# EAGLE design RGB 32x64 Shield for Arduino Mega (EAGLE 9.0.0)
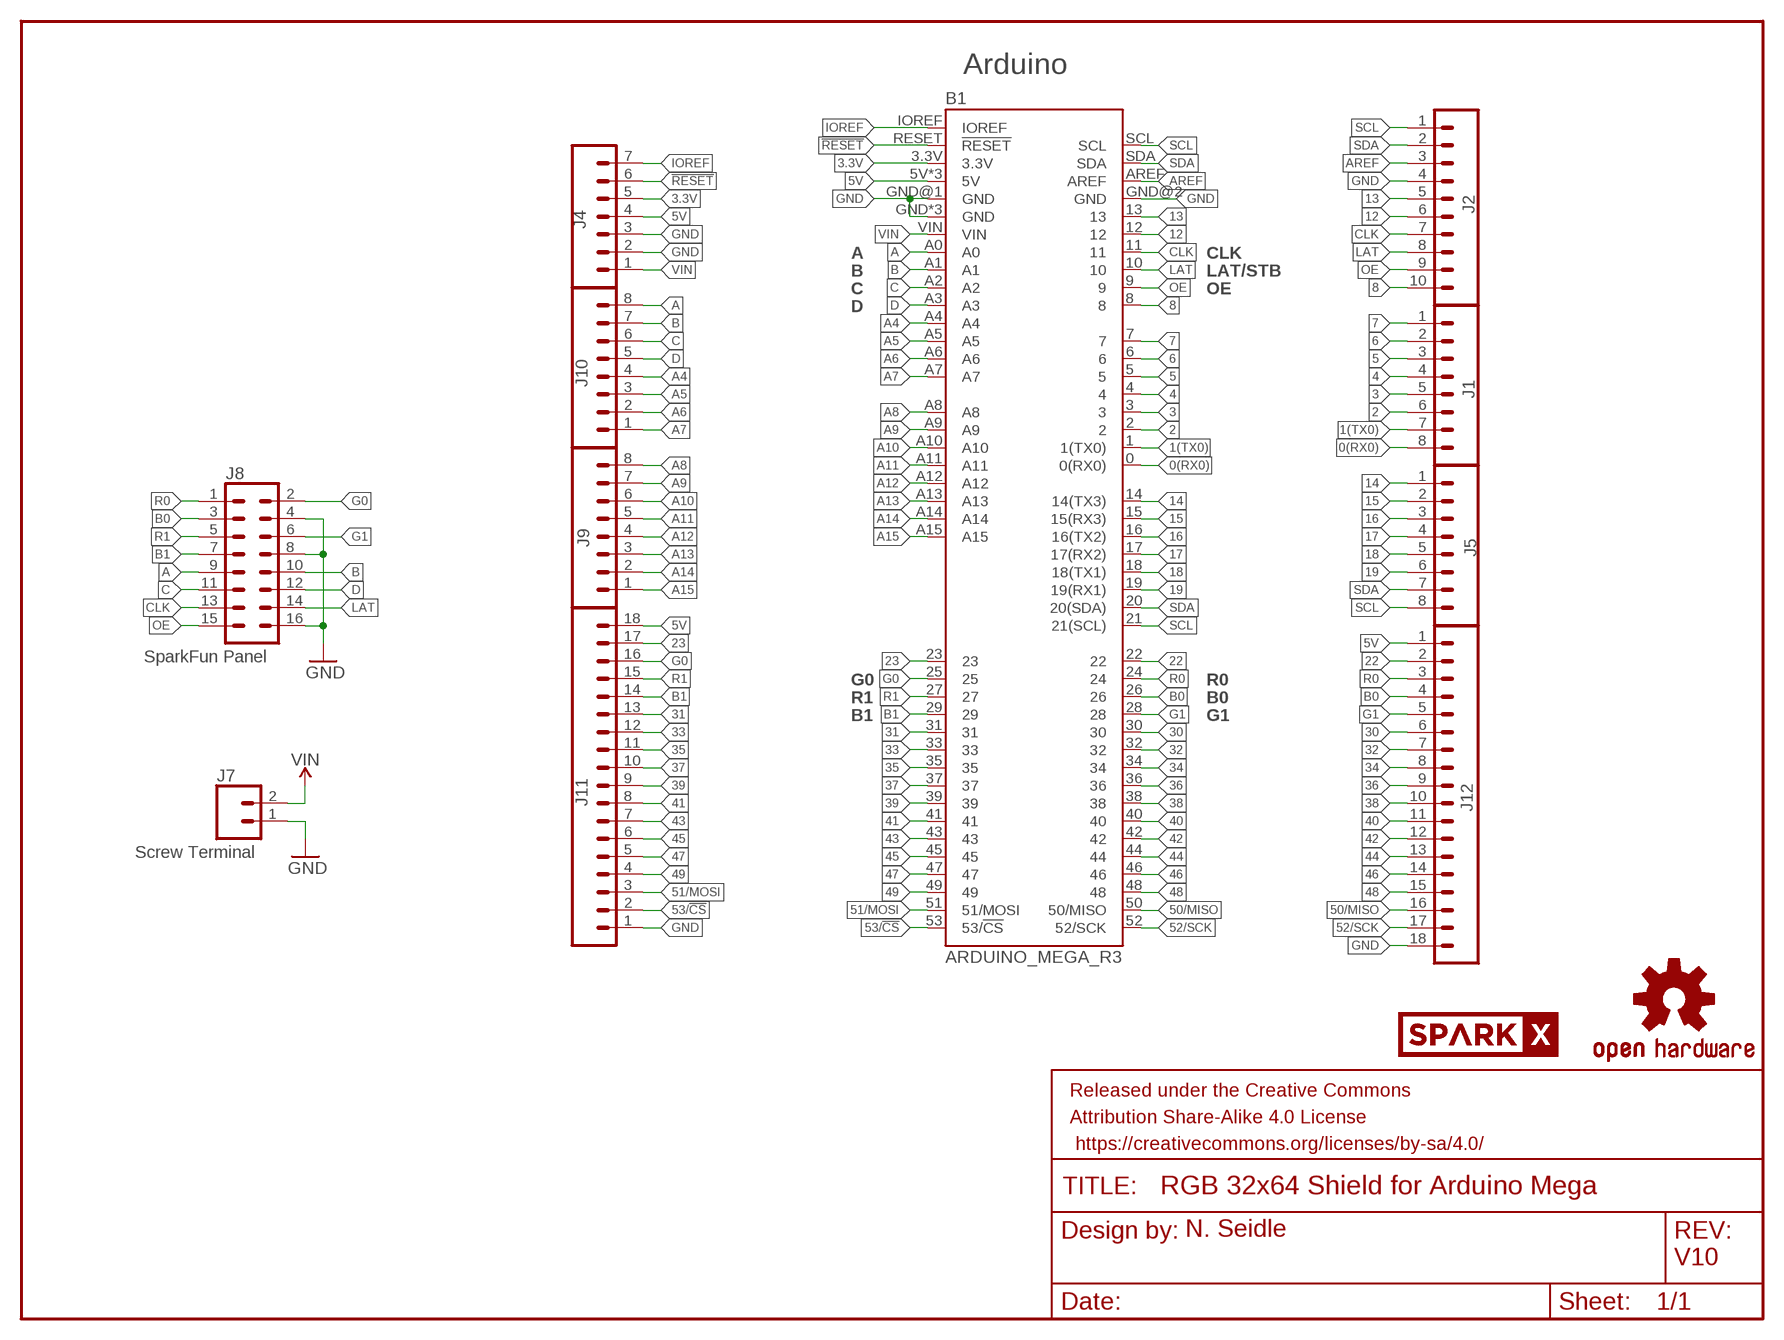
[diagram p0: schematic, sheet 1]

## Parts
B1  ARDUINO_MEGA_R3  ARDUINO_MEGA_R3FULL  [ARDUINO_MEGA_NO_SILK]
FRAME1  FRAME-LETTER  [CREATIVE_COMMONS]
J1  CONN_08NO_SILK_FEMALE_PTH  [1X08_NO_SILK]
J2  CONN_10NO_SILK_PTH_FEMALE  [1X10_NO_SILK]
J4  CONN_07NO_SILK  [1X07_NO_SILK]
J5  CONN_08NO_SILK_FEMALE_PTH  [1X08_NO_SILK]
J7  Screw Terminal  CONN_025MM  [SCREWTERMINAL-5MM-2]
J8  SparkFun Panel  CONN_08X2_SHROUD  [2X8-SHROUDED_LOCK]
J9  CONN_08NO_SILK_FEMALE_PTH  [1X08_NO_SILK]
J10  CONN_08NO_SILK_FEMALE_PTH  [1X08_NO_SILK]
J11  CONN_18  [1X18_NO_SILK]
J12  CONN_18  [1X18_NO_SILK]
LOGO1  OSHW-LOGOMINI  [OSHW-LOGO-MINI]
U$91  SPARKX-LOGO4  [SPARKX-MEDIUM]

## Nets
0(RX0): B1.0(0(RX0)) J1.8
1(TX0): B1.1(1(TX0)) J1.7
2: B1.2 J1.6
3: B1.3 J1.5
3.3V: B1.3.3V J4.5
4: B1.4 J1.4
5: B1.5 J1.3
5V: B1.5V B1.5V@1(5V) B1.5V@2(5V) J4.4 J11.18 J12.1
6: B1.6 J1.2
7: B1.7 J1.1
8: B1.8 J2.10
12: B1.12 J2.6
13: B1.13 J2.5
14: B1.14(14(TX3)) J5.1
15: B1.15(15(RX3)) J5.2
16: B1.16(16(TX2)) J5.3
17: B1.17(17(RX2)) J5.4
18: B1.18(18(TX1)) J5.5
19: B1.19(19(RX1)) J5.6
22: B1.22 J12.2
23: B1.23 J11.17
30: B1.30 J12.6
31: B1.31 J11.13
32: B1.32 J12.7
33: B1.33 J11.12
34: B1.34 J12.8
35: B1.35 J11.11
36: B1.36 J12.9
37: B1.37 J11.10
38: B1.38 J12.10
39: B1.39 J11.9
40: B1.40 J12.11
41: B1.41 J11.8
42: B1.42 J12.12
43: B1.43 J11.7
44: B1.44 J12.13
45: B1.45 J11.6
46: B1.46 J12.14
47: B1.47 J11.5
48: B1.48 J12.15
49: B1.49 J11.4
50/MISO: B1.50(50/MISO) J12.16
51/MOSI: B1.51(51/MOSI) J11.3
52/SCK: B1.52(52/SCK) J12.17
53/!CS: B1.53(53/!CS) J11.2
!RESET: B1.RESET(!RESET) J4.6
A: B1.A0 J8.9 J10.8
A4: B1.A4 J10.4
A5: B1.A5 J10.3
A6: B1.A6 J10.2
A7: B1.A7 J10.1
A8: B1.A8 J9.8
A9: B1.A9 J9.7
A10: B1.A10 J9.6
A11: B1.A11 J9.5
A12: B1.A12 J9.4
A13: B1.A13 J9.3
A14: B1.A14 J9.2
A15: B1.A15 J9.1
AREF: B1.AREF J2.3
B: B1.A1 J8.10 J10.7
B0: B1.26 J8.3 J12.4
B1: B1.29 J8.7 J11.14
C: B1.A2 J8.11 J10.6
CLK: B1.11 J2.7 J8.13
D: B1.A3 J8.12 J10.5
G0: B1.25 J8.2 J11.16
G1: B1.28 J8.6 J12.5
GND [vcc]: B1.GND B1.GND@1(GND) B1.GND@2(GND) B1.GND@3(GND) B1.GND@4(GND) J2.4 J4.2 J4.3 J7.1 J8.4 J8.8 J8.16 J11.1 J12.18
IOREF: B1.IOREF J4.7
LAT: B1.10 J2.8 J8.14
OE: B1.9 J2.9 J8.15
R0: B1.24 J8.1 J12.3
R1: B1.27 J8.5 J11.15
SCL: B1.21(21(SCL)) B1.SCL J2.1 J5.8
SDA: B1.20(20(SDA)) B1.SDA J2.2 J5.7
VIN [vcc]: B1.VIN J4.1 J7.2

## Notes on the sheet
- Arduino
- A | CLK
- B | LAT/STB
- C | OE
- D
- G0 | R0
- R1 | B0
- B1 | G1
- N. Seidle
- V10

## Library data of the parts
B1 = SparkFun-Boards:ARDUINO_MEGA_R3: Arduino Mega R3 ATmega2560 R3 compatible footprint. SparkFun Products: Arduino Mega 2560 R3 <https://www.sparkfun.com/products/11061>
FRAME1 = SparkFun-Aesthetics:FRAME-LETTER: Schematic Frame - Letter Standard 8.5x11 US Letter frame
J1 J5 J9 J10 = SparkFun-Connectors:CONN_08: Multi connection point. Often used as Generic Header-pin footprint for 0.1 inch spaced/style header connections On any of the 0.1 inch spaced packages, you can populate with these: Break Away Headers - Straight <https://www.sparkfun.com/products/116> (PRT-00116) Break Away Male Headers - Right Angle <https://www.sparkfun.com/products/553> (PRT-00553) Female Headers <https://www.sparkfun.com/products/115> (PRT-00115) Break Away Headers - Machine Pin <https://www.sparkfun.com/products/117> (PRT-00117) Break Away Female Headers - Swiss Machine Pin <https://www.sparkfun.com/products/743> (PRT-00743) Arduino Stackable Header - 8 Pin <https://www.sparkfun.com/products/9279> (PRT-09279) For SCREWTERMINALS and SPRING TERMINALS visit here: Screw Terimnals on SparkFun.com <https://www.sparkfun.com/search/results?term=Screw+Terminals> (5mm/3.5mm/2.54mm spacing) This device is also useful as a general connection point to wire up your design to another part of your project. Our various solder wires solder well into these plated through hole pads. Hook-Up Wire - Assortment (Stranded, 22 AWG) <https://www.sparkfun.com/products/11375> (PRT-11375) Hook-Up Wire - Assortment (Solid Core, 22 AWG) <https://www.sparkfun.com/products/11367> (PRT-11367) View the entire wire category on our website here <https://www.sparkfun.com/categories/141> Special notes: Molex polarized connector foot print use with SKU : PRT-08231 with associated crimp pins and housings. 1MM SMD Version SKU: PRT-10208 NOTES ON THE VARIANTS LOCK and LOCK_LONGPADS... This footprint was designed to help hold the alignment of a through-hole component (i.e. 6-pin header) while soldering it into place. You may notice that each hole has been shifted either up or down by 0.005 of an inch from it's more standard position (which is a perfectly straight line). This slight alteration caused the pins (the squares in the middle) to touch the edges of the holes. Because they are alternating, it causes a "brace" to hold the component in place. 0.005 has proven to be the perfect amount of "off-center" position when using our standard breakaway headers. Although looks a little odd when you look at the bare footprint, once you have a header in there, the alteration is very hard to notice. Also,if you push a header all the way into place, it is covered up entirely on the bottom side.; PROD_ID: CONN-08438
J2 = SparkFun-Connectors:CONN_10: Multi connection point. Often used as Generic Header-pin footprint for 0.1 inch spaced/style header connections On any of the 0.1 inch spaced packages, you can populate with these: Break Away Headers - Straight <https://www.sparkfun.com/products/116> (PRT-00116) Break Away Male Headers - Right Angle <https://www.sparkfun.com/products/553> (PRT-00553) Female Headers <https://www.sparkfun.com/products/115> (PRT-00115) Break Away Headers - Machine Pin <https://www.sparkfun.com/products/117> (PRT-00117) Break Away Female Headers - Swiss Machine Pin <https://www.sparkfun.com/products/743> (PRT-00743) Arduino Stackable Header - 10 Pin <https://www.sparkfun.com/products/11376> (PRT-11376) For SCREWTERMINALS and SPRING TERMINALS visit here: Screw Terimnals on SparkFun.com <https://www.sparkfun.com/search/results?term=Screw+Terminals> (5mm/3.5mm/2.54mm spacing) This device is also useful as a general connection point to wire up your design to another part of your project. Our various solder wires solder well into these plated through hole pads. Hook-Up Wire - Assortment (Stranded, 22 AWG) <https://www.sparkfun.com/products/11375> (PRT-11375) Hook-Up Wire - Assortment (Solid Core, 22 AWG) <https://www.sparkfun.com/products/11367> (PRT-11367) View the entire wire category on our website here <https://www.sparkfun.com/categories/141> Special notes: Molex polarized connector foot print use with SKU : PRT-08231 with associated crimp pins and housings. 1MM SMD Version SKU: PRT-10208 NOTES ON THE VARIANTS LOCK and LOCK_LONGPADS... This footprint was designed to help hold the alignment of a through-hole component (i.e. 6-pin header) while soldering it into place. You may notice that each hole has been shifted either up or down by 0.005 of an inch from it's more standard position (which is a perfectly straight line). This slight alteration caused the pins (the squares in the middle) to touch the edges of the holes. Because they are alternating, it causes a "brace" to hold the component in place. 0.005 has proven to be the perfect amount of "off-center" position when using our standard breakaway headers. Although looks a little odd when you look at the bare footprint, once you have a header in there, the alteration is very hard to notice. Also,if you push a header all the way into place, it is covered up entirely on the bottom side.; PROD_ID: CONN-11563
J4 = SparkFun-Connectors:CONN_07: Multi connection point. Often used as Generic Header-pin footprint for 0.1 inch spaced/style header connections On any of the 0.1 inch spaced packages, you can populate with these: Break Away Headers - Straight <https://www.sparkfun.com/products/116> (PRT-00116) Break Away Male Headers - Right Angle <https://www.sparkfun.com/products/553> (PRT-00553) Female Headers <https://www.sparkfun.com/products/115> (PRT-00115) Break Away Headers - Machine Pin <https://www.sparkfun.com/products/117> (PRT-00117) Break Away Female Headers - Swiss Machine Pin <https://www.sparkfun.com/products/743> (PRT-00743) For SCREWTERMINALS and SPRING TERMINALS visit here: Screw Terimnals on SparkFun.com <https://www.sparkfun.com/search/results?term=Screw+Terminals> (5mm/3.5mm/2.54mm spacing) This device is also useful as a general connection point to wire up your design to another part of your project. Our various solder wires solder well into these plated through hole pads. Hook-Up Wire - Assortment (Stranded, 22 AWG) <https://www.sparkfun.com/products/11375> (PRT-11375) Hook-Up Wire - Assortment (Solid Core, 22 AWG) <https://www.sparkfun.com/products/11367> (PRT-11367) View the entire wire category on our website here <https://www.sparkfun.com/categories/141> Special notes: Molex polarized connector foot print use with SKU : PRT-08231 with associated crimp pins and housings. 1MM SMD Version SKU: PRT-10208 NOTES ON THE VARIANTS LOCK and LOCK_LONGPADS... This footprint was designed to help hold the alignment of a through-hole component (i.e. 6-pin header) while soldering it into place. You may notice that each hole has been shifted either up or down by 0.005 of an inch from it's more standard position (which is a perfectly straight line). This slight alteration caused the pins (the squares in the middle) to touch the edges of the holes. Because they are alternating, it causes a "brace" to hold the component in place. 0.005 has proven to be the perfect amount of "off-center" position when using our standard breakaway headers. Although looks a little odd when you look at the bare footprint, once you have a header in there, the alteration is very hard to notice. Also,if you push a header all the way into place, it is covered up entirely on the bottom side.
J7 = SparkFun-Connectors:CONN_02: Multi connection point. Often used as Generic Header-pin footprint for 0.1 inch spaced/style header connections On any of the 0.1 inch spaced packages, you can populate with these: Break Away Headers - Straight <https://www.sparkfun.com/products/116> (PRT-00116) Break Away Male Headers - Right Angle <https://www.sparkfun.com/products/553> (PRT-00553) Female Headers <https://www.sparkfun.com/products/115> (PRT-00115) Break Away Headers - Machine Pin <https://www.sparkfun.com/products/117> (PRT-00117) Break Away Female Headers - Swiss Machine Pin <https://www.sparkfun.com/products/743> (PRT-00743) For SCREWTERMINALS and SPRING TERMINALS visit here: Screw Terimnals on SparkFun.com <https://www.sparkfun.com/search/results?term=Screw+Terminals> (5mm/3.5mm/2.54mm spacing) This device is also useful as a general connection point to wire up your design to another part of your project. Our various solder wires solder well into these plated through hole pads. Hook-Up Wire - Assortment (Stranded, 22 AWG) <https://www.sparkfun.com/products/11375> (PRT-11375) Hook-Up Wire - Assortment (Solid Core, 22 AWG) <https://www.sparkfun.com/products/11367> (PRT-11367) View the entire wire category on our website here <https://www.sparkfun.com/categories/141> Special notes: Molex polarized connector foot print use with: PRT-08233 with associated crimp pins and housings. 2.54_SCREWTERM for use with PRT-10571. 3.5mm Screw Terminal footprints for PRT-08084 5mm Screw Terminal footprints for use with PRT-08432; SF_SKU: PRT-08432
J8 = SparkFun-Connectors:CONN_08X2: Multi connection point. Often used as Generic Header-pin footprint for 0.1 inch spaced/style header connections You can populate with any combo of single row headers, but if you'd like an exact match, check this: Header - 2x8 (Male, 0.1") <https://www.sparkfun.com/products/13156> (PRT-13156) On any of the 0.1 inch spaced packages, you can populate with these: Break Away Headers - Straight <https://www.sparkfun.com/products/116> (PRT-00116) Break Away Male Headers - Right Angle <https://www.sparkfun.com/products/553> (PRT-00553) Female Headers <https://www.sparkfun.com/products/115> (PRT-00115) Break Away Headers - Machine Pin <https://www.sparkfun.com/products/117> (PRT-00117) Break Away Female Headers - Swiss Machine Pin <https://www.sparkfun.com/products/743> (PRT-00743)
J11 J12 = SparkFun-Connectors:CONN_18: Multi connection point. Often used as Generic Header-pin footprint for 0.1 inch spaced/style header connections On any of the 0.1 inch spaced packages, you can populate with these: Break Away Headers - Straight <https://www.sparkfun.com/products/116> (PRT-00116) Break Away Male Headers - Right Angle <https://www.sparkfun.com/products/553> (PRT-00553) Female Headers <https://www.sparkfun.com/products/115> (PRT-00115) Break Away Headers - Machine Pin <https://www.sparkfun.com/products/117> (PRT-00117) Break Away Female Headers - Swiss Machine Pin <https://www.sparkfun.com/products/743> (PRT-00743) For SCREWTERMINALS and SPRING TERMINALS visit here: Screw Terimnals on SparkFun.com <https://www.sparkfun.com/search/results?term=Screw+Terminals> (5mm/3.5mm/2.54mm spacing) This device is also useful as a general connection point to wire up your design to another part of your project. Our various solder wires solder well into these plated through hole pads. Hook-Up Wire - Assortment (Stranded, 22 AWG) <https://www.sparkfun.com/products/11375> (PRT-11375) Hook-Up Wire - Assortment (Solid Core, 22 AWG) <https://www.sparkfun.com/products/11367> (PRT-11367) View the entire wire category on our website here <https://www.sparkfun.com/categories/141> Special notes: Molex polarized connector foot print use with SKU : PRT-08231 with associated crimp pins and housings. 1MM SMD Version SKU: PRT-10208 NOTES ON THE VARIANTS LOCK and LOCK_LONGPADS... This footprint was designed to help hold the alignment of a through-hole component (i.e. 6-pin header) while soldering it into place. You may notice that each hole has been shifted either up or down by 0.005 of an inch from it's more standard position (which is a perfectly straight line). This slight alteration caused the pins (the squares in the middle) to touch the edges of the holes. Because they are alternating, it causes a "brace" to hold the component in place. 0.005 has proven to be the perfect amount of "off-center" position when using our standard breakaway headers. Although looks a little odd when you look at the bare footprint, once you have a header in there, the alteration is very hard to notice. Also,if you push a header all the way into place, it is covered up entirely on the bottom side.
LOGO1 = SparkFun-Aesthetics:OSHW-LOGO: Open-Source Hardware (OSHW) Logo This logo indicates the piece of hardware it is found on incorporates a OSHW license and/or adheres to the definition of open source hardware found here: http://freedomdefined.org/OSHW
U$91 = SparkX:SPARKX-LOGO

## Net classes
0 Default: width 0.152 mm
1 vcc: width 0.152 mm

## Board
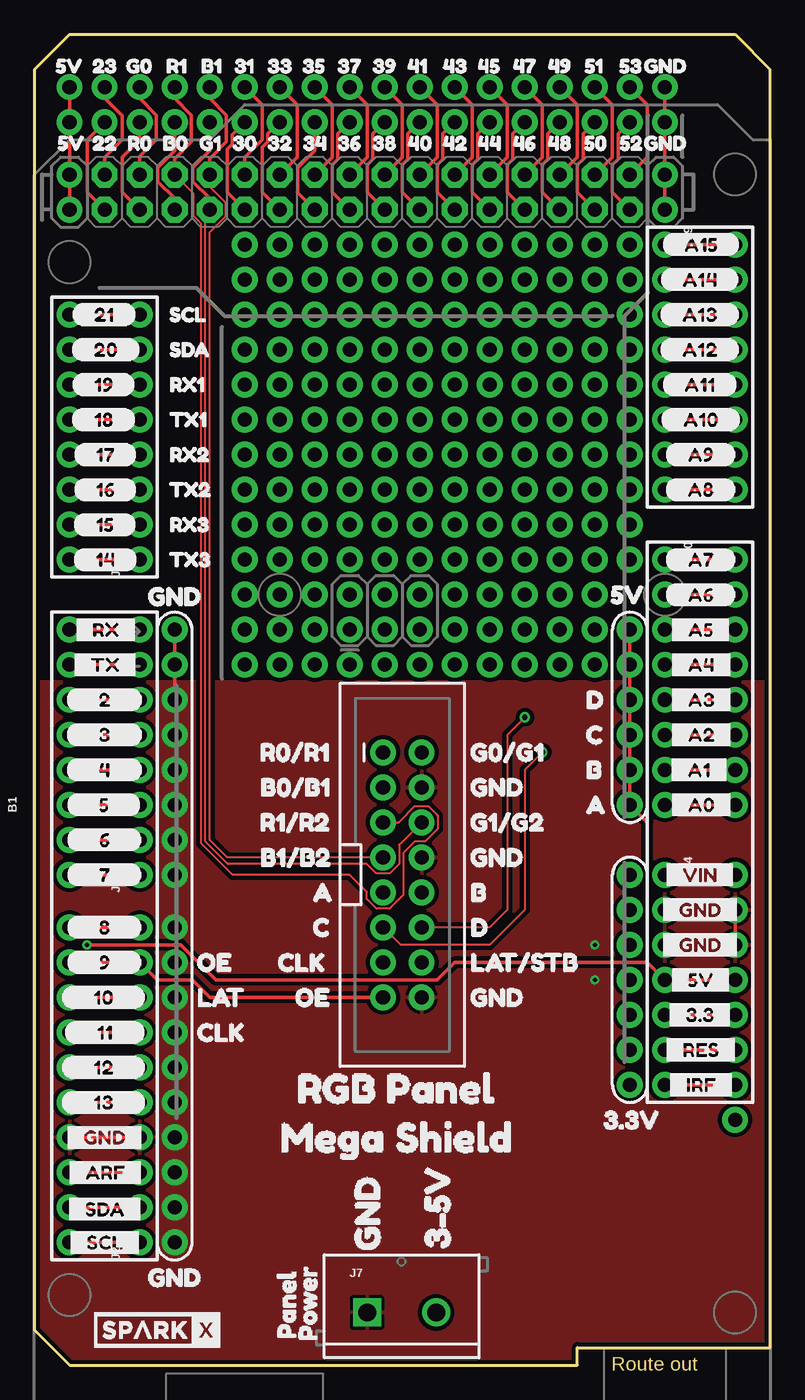
[diagram p1: board, top side]
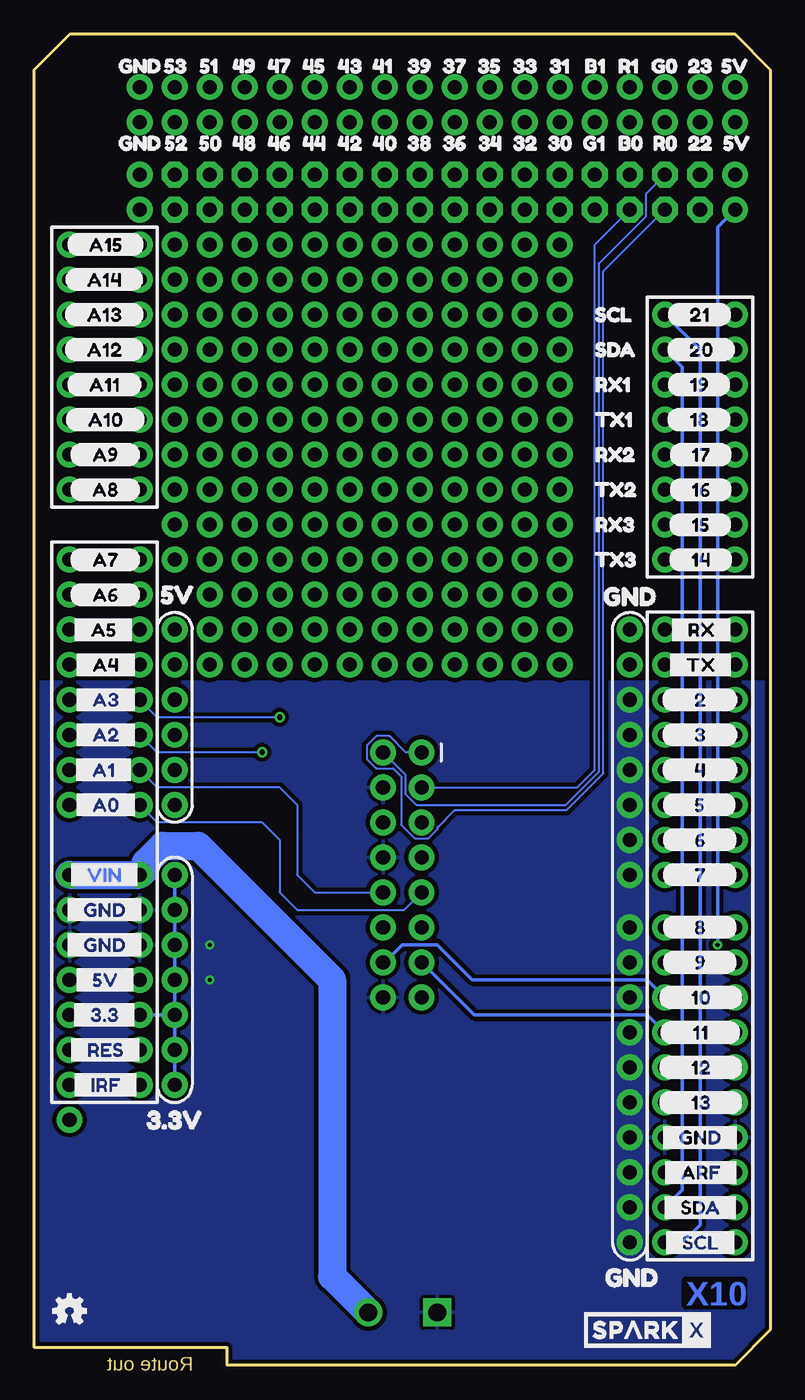
[diagram p2: board, bottom side, seen from below]

Size 53.34 x 96.52 mm. Coordinates in mm from the lower left corner, seen from the top.
Outline: 53.34,1.27 53.34,93.98 50.8,96.52 2.54,96.52 0,93.98 0,2.54 2.54,0 39.37,0 39.37,1.27 53.34,1.27
Copper layers (1*16): Top 0.035mm / dielectric 1.5mm / Bottom 0.035mm
Design rules "SparkFun-2-layer-PCBWay-LIMIT": minimum track width 6mil, minimum drill 0.3mm, track to track 6mil, track to pad 6mil, pad to pad 6mil, via to via 6mil, smd to smd 6mil, copper to edge 6mil, drill to drill 6mil, minimum pad ring 7mil, minimum via ring 7mil, stop-mask expansion 4mil, vias tented up to drill 25mil, thermal gap 10mil

### Footprints (pad centres in the part's own frame; a part is rotated, then mirrored left to right if it is on the bottom)
ARDUINO_MEGA_NO_SILK = drill 1.016 pad 1.88: 0 13.97,24.13; 1 11.43,24.13; 2 8.89,24.13; 3 6.35,24.13; 3.3V -13.97,-24.13; 4 3.81,24.13; 5 1.27,24.13; 5V -11.43,-24.13; 5V@1 44.45,24.13; 5V@2 46.99,24.13; 6 -1.27,24.13; 7 -3.81,24.13; 8 -7.62,24.13; 9 -10.16,24.13; 10 -12.7,24.13; 11 -15.24,24.13; 12 -17.78,24.13; 13 -20.32,24.13; 14 19.05,24.13; 15 21.59,24.13; 16 24.13,24.13; 17 26.67,24.13; 18 29.21,24.13; 19 31.75,24.13; 20 34.29,24.13; 21 36.83,24.13; A0 1.27,-24.13; A1 3.81,-24.13; A2 6.35,-24.13; A3 8.89,-24.13; A4 11.43,-24.13; A5 13.97,-24.13; A6 16.51,-24.13; A7 19.05,-24.13; A8 24.13,-24.13; A9 26.67,-24.13; A10 29.21,-24.13; A11 31.75,-24.13; A12 34.29,-24.13; A13 36.83,-24.13; A14 39.37,-24.13; A15 41.91,-24.13; AREF -25.4,24.13; GND -8.89,-24.13; GND@1 -6.35,-24.13; GND@2 44.45,-19.05; GND@3 46.99,-19.05; GND@4 -22.86,24.13; IOREF -19.05,-24.13; NC -21.59,-24.13; RESET -16.51,-24.13; SCL -30.48,24.13; SDA -27.94,24.13; VIN -3.81,-24.13 | drill 1.016 pad 1.88 octagon: 22 44.45,21.59; 23 46.99,21.59; 24 44.45,19.05; 25 46.99,19.05; 26 44.45,16.51; 27 46.99,16.51; 28 44.45,13.97; 29 46.99,13.97; 30 44.45,11.43; 31 46.99,11.43; 32 44.45,8.89; 33 46.99,8.89; 34 44.45,6.35; 35 46.99,6.35; 36 44.45,3.81; 37 46.99,3.81; 38 44.45,1.27; 39 46.99,1.27; 40 44.45,-1.27; 41 46.99,-1.27; 42 44.45,-3.81; 43 46.99,-3.81; 44 44.45,-6.35; 45 46.99,-6.35; 46 44.45,-8.89; 47 46.99,-8.89; 48 44.45,-11.43; 49 46.99,-11.43; 50 44.45,-13.97; 51 46.99,-13.97; 52 44.45,-16.51; 53 46.99,-16.51
1X08_NO_SILK = drill 1.016 pad 1.88: 1 0,0; 2 2.54,0; 3 5.08,0; 4 7.62,0; 5 10.16,0; 6 12.7,0; 7 15.24,0; 8 17.78,0
1X10_NO_SILK = drill 1.016 pad 1.88: 1 0,0; 2 2.54,0; 3 5.08,0; 4 7.62,0; 5 10.16,0; 6 12.7,0; 7 15.24,0; 8 17.78,0; 9 20.32,0; 10 22.86,0
1X07_NO_SILK = drill 1.016 pad 1.88: 1 0,0; 2 2.54,0; 3 5.08,0; 4 7.62,0; 5 10.16,0; 6 12.7,0; 7 15.24,0
SCREWTERMINAL-5MM-2 = drill 1.3 pad 2.032 square: 1 0,0 | drill 1.3 pad 2.032: 2 5,0
2X8-SHROUDED_LOCK = drill 1.016 pad 1.88: 1 -1.397,8.89; 2 1.397,8.89; 3 -1.397,6.35; 4 1.397,6.35; 5 -1.397,3.81; 6 1.397,3.81; 7 -1.397,1.27; 8 1.397,1.27; 9 -1.397,-1.27; 10 1.397,-1.27; 11 -1.397,-3.81; 12 1.397,-3.81; 13 -1.397,-6.35; 14 1.397,-6.35; 15 -1.397,-8.89; 16 1.397,-8.89
1X18_NO_SILK = drill 1.016 pad 1.88: 1 0,0; 2 2.54,0; 3 5.08,0; 4 7.62,0; 5 10.16,0; 6 12.7,0; 7 15.24,0; 8 17.78,0; 9 20.32,0; 10 22.86,0; 11 25.4,0; 12 27.94,0; 13 30.48,0; 14 33.02,0; 15 35.56,0; 16 38.1,0; 17 40.64,0; 18 43.18,0

### Placement (x,y rotation side)
B1  26.67,39.37 90 top
FRAME1  -8.89,-29.21 0 top  (outside the outline)
J1  7.62,35.56 90 top
J2  7.62,8.89 90 top
J4  45.72,35.56 270 top
J5  7.62,58.42 90 top
J7  24.13,3.81 0 top
J8  26.67,35.56 0 top
J9  45.72,81.28 270 top
J10  45.72,58.42 270 top
J11  45.72,92.71 180 top
J12  2.54,90.17 0 top
LOGO1  50.8,3.94 0 bottom
U$1  [D42]  38.86,48.26 0 top
U$2  [__A6__0]  45.72,55.88 0 top
U$3  [C37]  19.05,31.75 0 top
U$4  [GND48]  30.48,41.91 0 top
U$5  [3#5V3]  29.21,6.86 90 top
U$6  [____2____1]  2.29,48.26 0 top
U$7  [____3____3]  2.29,45.72 0 top
U$8  [____4____4]  2.29,43.18 0 top
U$9  [____5____5]  2.29,40.64 0 top
U$10  [____6____6]  2.29,38.1 0 top
U$11  [GND2]  24.13,6.73 90 top
U$12  [____7____7]  2.29,35.56 0 top
U$13  [____8____8]  2.29,31.75 0 top
U$14  [____9____9]  2.29,29.21 0 top
U$15  [____10____10]  1.91,26.67 0 top
U$16  [PANEL0]  18.29,0.76 90 top
U$17  [____11____11]  2.16,24.13 0 top
U$18  [____12____12]  1.91,21.59 0 top
U$19  [POWER1]  19.81,0.64 90 top
U$20  [____13____13]  1.91,19.05 0 top
U$21  [GND40]  7.11,6.35 0 top
U$22  [GND40]  7.11,55.75 0 top
U$23  [RGB_PANEL2]  17.27,20.07 0 top
U$24  [__RX__0]  2.54,53.34 0 top
U$25  [3#3V46]  40.13,17.78 0 top
U$26  [5V47]  40.64,55.88 0 top
U$27  [__3#3__27]  50.93,25.4 0 bottom
U$28  [A36]  19.05,34.29 0 top
U$29  [B0#B132]  15.24,41.91 0 top
U$30  [B1#B235]  15.24,36.83 0 top
U$31  [B43]  30.48,34.29 0 top
U$32  [C37]  19.05,31.75 0 top
U$33  [CLK38]  16.51,29.21 0 top
U$34  [D42]  30.48,31.75 0 top
U$35  [G0#G145]  30.48,44.45 0 top
U$36  [G1#G244]  30.48,39.37 0 top
U$37  [GND40]  30.48,26.67 0 top
U$38  [GND48]  30.48,36.83 0 top
U$39  [LAT#STB41]  30.48,29.21 0 top
U$40  [OE39]  17.78,26.67 0 top
U$41  [R0#R131]  15.24,44.45 0 top
U$42  [R1#R234]  15.24,39.37 0 top
U$43  [__5V__26]  50.8,27.94 0 bottom
U$44  [__A0__23]  45.72,40.64 0 top
U$45  [__3#3__27]  45.59,25.4 0 top
U$46  [__A1__22]  45.72,43.18 0 top
U$47  [__A2__21]  45.72,45.72 0 top
U$48  [__5V__26]  45.72,27.94 0 top
U$49  [__A3__20]  45.72,48.26 0 top
U$50  [__A4__19]  45.72,50.8 0 top
U$51  [__A5__18]  45.72,53.34 0 top
U$52  [__ARF__15]  2.03,13.97 0 top
U$53  [__GND__14]  1.91,16.51 0 top
U$54  [__GND__25]  45.09,30.48 0 top
U$55  [__GND__25]  45.09,33.02 0 top
U$56  [__IRF__29]  45.59,20.32 0 top
U$57  [__RES__28]  45.34,22.86 0 top
U$58  [__SCL__17]  2.16,8.89 0 top
U$59  [__SDA__16]  2.03,11.3 0 top
U$60  [__TX__0]  2.41,50.8 0 top
U$61  [__VIN__24]  45.34,35.56 0 top
U$62  [__A0__23]  50.8,40.64 0 bottom
U$63  [__A1__22]  50.8,43.18 0 bottom
U$64  [__A2__21]  50.8,45.72 0 bottom
U$65  [__A3__20]  50.8,48.26 0 bottom
U$66  [__A4__19]  50.8,50.8 0 bottom
U$67  [__GND__25]  51.44,30.48 0 bottom
U$68  [__GND__25]  51.44,33.02 0 bottom
U$69  [__RES__28]  51.18,22.86 0 bottom
U$70  [__VIN__24]  51.18,35.56 0 bottom
U$71  [__IRF__29]  50.93,20.32 0 bottom
U$72  [__A5__18]  50.93,53.34 0 bottom
U$73  [__RX__0]  7.62,53.34 0 bottom
U$74  [__ARF__15]  8.13,13.97 0 bottom
U$75  [__GND__14]  8.26,16.51 0 bottom
U$76  [__SCL__17]  8,8.89 0 bottom
U$77  [__SDA__16]  8.13,11.43 0 bottom
U$78  [__TX__0]  7.75,50.8 0 bottom
U$79  [____2____1]  7.87,48.26 0 bottom
U$80  [____3____3]  7.87,45.72 0 bottom
U$81  [____4____4]  7.87,43.18 0 bottom
U$82  [____5____5]  7.87,40.64 0 bottom
U$83  [____6____6]  7.87,38.1 0 bottom
U$84  [____7____7]  7.87,35.56 0 bottom
U$85  [____8____8]  7.87,31.75 0 bottom
U$86  [____9____9]  7.87,29.21 0 bottom
U$87  [____10____10]  8.13,26.67 0 bottom
U$88  [____11____11]  8,24.13 0 bottom
U$89  [____12____12]  8.13,21.59 0 bottom
U$90  [____13____13]  8.13,19.05 0 bottom
U$91  8.89,2.54 0 top
U$92  [__A7__0]  45.72,58.42 0 top
U$93  [__A8__1]  45.72,63.5 0 top
U$94  [__A9__2]  45.72,66.04 0 top
U$95  [__A10__3]  45.21,68.58 0 top
U$96  [__A11__4]  45.47,71.12 0 top
U$97  [__A12__5]  45.34,73.66 0 top
U$98  [__A13__6]  45.34,76.2 0 top
U$99  [__A14__7]  45.34,78.74 0 top
U$100  [__A15__8]  45.47,81.28 0 top
U$101  [__14__0]  2.79,58.42 0 top
U$102  [__15__1]  2.79,60.96 0 top
U$103  [__16__2]  2.79,63.5 0 top
U$104  [__17__3]  2.79,66.04 0 top
U$105  [__18__4]  2.67,68.58 0 top
U$106  [__19__5]  2.67,71.12 0 top
U$107  [5V47]  45.34,55.88 0 bottom
U$108  [GND40]  13.21,55.75 0 bottom
U$109  [GND40]  13.08,6.35 0 bottom
U$110  [3#3V46]  46.35,17.78 0 bottom
U$111  [__20__6]  2.67,73.66 0 top
U$112  [__14__0]  7.37,58.42 0 bottom
U$113  [C37]  38.86,45.72 0 top
U$114  [B43]  38.86,43.18 0 top
U$115  [A36]  38.86,40.64 0 top
U$116  [__15__1]  7.37,60.96 0 bottom
U$117  [__16__2]  7.37,63.5 0 bottom
U$118  [__17__3]  7.37,66.04 0 bottom
U$119  [__18__4]  7.49,68.58 0 bottom
U$120  [__19__5]  7.49,71.12 0 bottom
U$121  [CLK38]  10.67,24.13 0 top
U$122  [OE39]  10.67,29.21 0 top
U$123  [LAT0]  10.67,26.67 0 top
U$124  [SHIELD0]  24.38,16.51 0 top
U$125  [__21__7]  2.67,76.2 0 top
U$126  [TX30]  8.89,58.42 0 top
U$127  [SDA2]  8.89,73.66 0 top
U$128  [SPARKX-MEDIUM]  8.89,2.54 0 bottom
U$129  [SCL3]  8.89,76.2 0 top
U$130  [RX31]  8.89,60.96 0 top
U$131  [MEGA4]  16,16.51 0 top
U$132  [__20__6]  7.49,73.66 0 bottom
U$133  [2232]  3.3,88.65 0 top
U$134  [__21__7]  7.49,76.2 0 bottom
U$135  [GND0]  43.31,94.23 0 top
U$136  [TX30]  13.59,58.42 0 bottom
U$137  [GND0]  43.31,88.65 0 top
U$138  [RX14]  8.89,71.12 0 top
U$139  [RX22]  8.89,66.04 0 top
U$140  [TX13]  8.89,68.58 0 top
U$141  [TX21]  8.89,63.5 0 top
U$142  [5V1]  0.64,94.23 0 top
U$143  [5V1]  0.76,88.65 0 top
U$144  [469]  33.78,88.65 0 top
U$145  [478]  33.78,94.23 0 top
U$146  [487]  36.32,88.65 0 top
U$147  [496]  36.32,94.23 0 top
U$148  [505]  38.99,88.65 0 top
U$149  [514]  38.99,94.23 0 top
U$150  [523]  41.53,88.65 0 top
U$151  [532]  41.53,94.23 0 top
U$152  [3025]  13.46,88.65 0 top
U$153  [3124]  13.59,94.23 0 top
U$154  [3223]  16,88.65 0 top
U$155  [3322]  16,94.23 0 top
U$156  [3421]  18.54,88.65 0 top
U$157  [3520]  18.54,94.23 0 top
U$158  [3619]  21.08,88.65 0 top
U$159  [3718]  21.08,94.23 0 top
U$160  [3817]  23.62,88.65 0 top
U$161  [3916]  23.62,94.23 0 top
U$162  [4015]  26.16,88.65 0 top
U$163  [4114]  26.16,94.23 0 top
U$164  [4213]  28.7,88.65 0 top
U$165  [4312]  28.7,94.23 0 top
U$166  [4411]  31.24,88.65 0 top
U$167  [4510]  31.24,94.23 0 top
U$168  [230]  3.3,94.23 0 top
U$169  [B02]  8.38,88.65 0 top
U$170  [B14]  11.18,94.23 0 top
U$171  [G05]  5.71,94.23 0 top
U$172  [G16]  11.05,88.65 0 top
U$173  [R01]  5.84,88.65 0 top
U$174  [R13]  8.64,94.23 0 top
U$175  [SDA2]  13.59,73.66 0 bottom
U$176  [SCL3]  13.59,76.2 0 bottom
U$177  [RX31]  13.59,60.96 0 bottom
U$178  [RX14]  13.59,71.12 0 bottom
U$179  [RX22]  13.59,66.04 0 bottom
U$180  [TX13]  13.59,68.58 0 bottom
U$181  [TX21]  13.59,63.5 0 bottom
U$182  [__A7__0]  50.8,58.42 0 bottom
U$183  [__A6__0]  50.8,55.88 0 bottom
U$184  [__A10__3]  51.31,68.58 0 bottom
U$185  [__A11__4]  51.05,71.12 0 bottom
U$186  [__A12__5]  51.18,73.66 0 bottom
U$187  [__A13__6]  51.18,76.2 0 bottom
U$188  [__A14__7]  51.18,78.74 0 bottom
U$189  [__A15__8]  51.05,81.28 0 bottom
U$190  [__A9__2]  50.8,66.04 0 bottom
U$191  [__A8__1]  50.8,63.5 0 bottom
U$192  [5V1]  4.45,94.23 0 bottom
U$193  [478]  37.34,94.23 0 bottom
U$194  [496]  39.88,94.23 0 bottom
U$195  [514]  42.29,94.23 0 bottom
U$196  [532]  44.83,94.23 0 bottom
U$197  [3124]  16.89,94.23 0 bottom
U$198  [3322]  19.56,94.23 0 bottom
U$199  [3520]  22.1,94.23 0 bottom
U$200  [3718]  24.64,94.23 0 bottom
U$201  [3916]  27.18,94.23 0 bottom
U$202  [4114]  29.72,94.23 0 bottom
U$203  [4312]  32.26,94.23 0 bottom
U$204  [4510]  34.8,94.23 0 bottom
U$205  [GND0]  48.13,94.23 0 bottom
U$206  [230]  6.86,94.23 0 bottom
U$207  [B14]  14.35,94.23 0 bottom
U$208  [G05]  9.53,94.23 0 bottom
U$209  [R13]  11.94,94.23 0 bottom
U$210  [5V1]  4.32,88.65 0 bottom
U$211  [469]  37.34,88.65 0 bottom
U$212  [487]  39.88,88.65 0 bottom
U$213  [505]  42.29,88.65 0 bottom
U$214  [523]  44.83,88.65 0 bottom
U$215  [3025]  17.02,88.65 0 bottom
U$216  [3223]  19.56,88.65 0 bottom
U$217  [3421]  22.1,88.65 0 bottom
U$218  [3619]  24.64,88.65 0 bottom
U$219  [3817]  27.18,88.65 0 bottom
U$220  [4015]  29.72,88.65 0 bottom
U$221  [4213]  32.26,88.65 0 bottom
U$222  [4411]  34.8,88.65 0 bottom
U$223  [2232]  6.86,88.65 0 bottom
U$224  [GND0]  48.13,88.65 0 bottom
U$225  [B02]  11.94,88.65 0 bottom
U$226  [G16]  14.48,88.65 0 bottom
U$227  [R01]  9.4,88.65 0 bottom

### Tracks (layer width: path | path; a pad name or v marks a point on that pad's centre or on a via)
0(RX0)
  Top 0.254: J1.8 B1.0
1(TX0)
  Top 0.254: B1.1 J1.7
2
  Top 0.254: J1.6 B1.2
3
  Top 0.254: B1.3 J1.5
3.3V  (via drill 1.02 pad 1.88)
  Top 0.254: B1.3.3V J4.5
  Bottom 0.254: v43.18,35.56 v43.18,33.02 v43.18,30.48 v43.18,27.94 v43.18,25.4 | v43.18,25.4 J4.5 | v43.18,25.4 v43.18,22.86 v43.18,20.32
4
  Top 0.254: J1.4 B1.4
5
  Top 0.254: B1.5 J1.3
5V  (via drill 0.3, 1.02 pad 1.88)
  Top 0.254: B1.5V J4.4 44.45,29.21 | B1.5V@1 B1.5V@2 J12.1 J11.18 | 44.45,29.21 44.45,39.37 v43.18,40.64 v43.18,43.18 v43.18,45.72 v43.18,48.26 v43.18,50.8 v43.18,53.34 | 44.45,29.21 30.48,29.21 29.21,27.94 13.15,27.94 10.61,30.48 v3.81,30.48
  Bottom 0.254: B1.5V@1 3.81,82.55 v3.81,30.48
6
  Top 0.254: J1.2 B1.6
7
  Top 0.254: B1.7 J1.1
8
  Top 0.254: J2.10 B1.8
12
  Top 0.254: J2.6 B1.12
13
  Top 0.254: B1.13 J2.5
14
  Top 0.254: J5.1 B1.14
15
  Top 0.254: B1.15 J5.2
16
  Top 0.254: J5.3 B1.16
17
  Top 0.254: B1.17 J5.4
18
  Top 0.254: B1.18 J5.5
19
  Top 0.254: J5.6 B1.19
22
  Top 0.254: B1.22 3.81,85.09 3.81,88.9 J12.2
23
  Top 0.254: J11.17 5.08,91.89 6.35,90.62 6.35,88.9 5.08,87.63 B1.23
30
  Top 0.254: B1.30 13.97,85.09 13.97,88.2 14.33,88.56 14.33,89.26 J12.6
31
  Top 0.254: B1.31 15.24,87.63 16.51,88.9 16.51,91.44 J11.13
32
  Top 0.254: B1.32 16.51,85.09 16.51,88.33 16.92,88.73 16.92,89.31 J12.7
33
  Top 0.254: B1.33 19.05,87.63 19.05,91.44 J11.12
34
  Top 0.254: B1.34 19.05,85.09 19.1,85.14 19.1,86.87 20.32,88.08 J12.8
35
  Top 0.254: B1.35 21.59,87.63 21.59,91.44 J11.11
36
  Top 0.254: B1.36 21.59,85.09 21.59,87.06 22,87.46 22,89.31 J12.9
37
  Top 0.254: B1.37 24.13,87.63 24.13,91.44 J11.10
38
  Top 0.254: B1.38 24.13,85.09 24.13,87.06 24.54,87.46 24.54,89.31 J12.10
39
  Top 0.254: B1.39 26.67,87.63 26.67,91.44 J11.9
40
  Top 0.254: B1.40 26.67,85.09 26.67,87.06 27.08,87.46 27.08,89.31 J12.11
41
  Top 0.254: B1.41 29.21,87.63 29.21,91.44 J11.8
42
  Top 0.254: B1.42 29.21,85.09 29.21,87.06 29.62,87.46 29.62,89.31 J12.12
43
  Top 0.254: B1.43 31.75,87.63 31.75,91.44 J11.7
44
  Top 0.254: B1.44 31.75,85.09 31.75,87.06 32.16,87.46 32.16,89.31 J12.13
45
  Top 0.254: B1.45 34.29,87.63 34.29,91.44 J11.6
46
  Top 0.254: B1.46 34.29,85.09 34.29,87.06 34.7,87.46 34.7,89.31 J12.14
47
  Top 0.254: B1.47 36.83,87.63 36.83,91.44 J11.5
48
  Top 0.254: B1.48 36.83,85.09 36.83,87.06 37.24,87.46 37.24,89.31 J12.15
49
  Top 0.254: B1.49 39.37,87.63 39.37,91.44 J11.4
50/MISO
  Top 0.254: B1.50 39.37,85.09 39.37,87.06 39.78,87.46 39.78,89.31 J12.16
51/MOSI
  Top 0.254: B1.51 41.91,87.63 41.91,91.44 J11.3
52/SCK
  Top 0.254: B1.52 41.91,85.09 41.91,87.06 42.32,87.46 42.32,89.31 J12.17
53/!CS
  Top 0.254: B1.53 44.45,87.63 44.45,91.44 J11.2
!RESET
  Top 0.254: B1.RESET J4.6
A
  Top 0.254: B1.A0 J10.8
  Bottom 0.152: J8.9 26.54,33.02 34.29,33.02 35.56,34.29 35.56,38.1 36.83,39.37 44.45,39.37 J10.8
A4
  Top 0.254: B1.A4 J10.4
A5
  Top 0.254: J10.3 B1.A5
A6
  Top 0.254: B1.A6 J10.2
A7
  Top 0.254: J10.1 B1.A7
A8
  Top 0.254: J9.8 B1.A8
A9
  Top 0.254: B1.A9 J9.7
A10
  Top 0.254: J9.6 B1.A10
A11
  Top 0.254: B1.A11 J9.5
A12
  Top 0.254: J9.4 B1.A12
A13
  Top 0.254: B1.A13 J9.3
A14
  Top 0.254: J9.2 B1.A14
A15
  Top 0.254: B1.A15 J9.1
AREF
  Top 0.254: B1.AREF J2.3
B
  Top 0.254: B1.A1 J10.7
  Bottom 0.152: J8.10 33.02,34.29 34.29,35.56 34.29,40.64 35.56,41.91 44.45,41.91 J10.7
B0
  Top 0.254: B1.26 10.16,84.64 8.94,85.86 8.94,86.87 10.16,88.08 J12.4
  Bottom 0.152: J8.3 13.97,41.91 12.7,43.18 12.7,81.28 B1.26
B1
  Top 0.152: B1.29 12.7,85.47 13.87,84.3 13.87,83.34 12.7,82.17 12.7,38.1 13.97,36.83 J8.7
  Top 0.254: B1.29 12.7,87.51 13.92,88.73 13.92,90.67 12.7,91.89 J11.14
C  (via drill 0.38)
  Top 0.152: v36.83,44.45 35.56,43.18 35.56,33.02 33.02,30.48 26.54,30.48 J8.11
  Top 0.254: B1.A2 J10.6
  Bottom 0.152: v36.83,44.45 44.45,44.45 J10.6
CLK
  Top 0.254: B1.11 J2.7
  Bottom 0.254: J8.13 21.46,25.4 8.89,25.4 J2.7
D  (via drill 0.38)
  Top 0.152: v35.56,46.99 34.29,45.72 34.29,33.02 33.02,31.75 J8.12
  Top 0.254: B1.A3 J10.5
  Bottom 0.152: v35.56,46.99 44.45,46.99 J10.5
G0
  Top 0.254: J11.16 7.62,91.89 8.84,90.67 8.84,88.9 7.62,87.68 B1.25
  Bottom 0.152: J8.2 26.44,42.82 26.44,41.43 25.66,40.64 14.81,40.64 12.39,43.05 12.39,79.93 8.99,83.34 8.99,84.99 B1.25
G1
  Top 0.152: J8.6 26.44,37.74 26.44,36.35 25.76,35.66 24.79,35.66 24.11,36.35 14.02,36.35 12.39,37.97 12.39,83.52 B1.28
  Top 0.254: B1.28 12.7,84.64 11.48,85.86 11.48,86.87 12.7,88.08 J12.5
GND  (via drill 0.3, 1.02 pad 1.88)
  Top 0.254: B1.GND B1.GND@1 | J2.4 B1.GND@4 | B1.GND@2 B1.GND@3 J12.18 J11.1 | v10.16,48.26 v10.16,50.8 v10.16,53.34
  other vias: 10.16,8.89 10.16,11.43 10.16,13.97 10.16,16.51 10.16,19.05 10.16,21.59 10.16,24.13 10.16,26.67 10.16,29.21 10.16,31.75 10.16,35.56 10.16,38.1 10.16,40.64 10.16,43.18 10.16,45.72 40.64,30.48 40.64,27.94
  pour Top (isolate 0.305): 53.34,0 0,0 0,49.53 53.34,49.53
  pour Bottom (isolate 0.305): 53.34,0 0,0 0,49.53 53.34,49.53
IOREF
  Top 0.254: B1.IOREF J4.7
LAT
  Top 0.254: J2.8 B1.10
  Bottom 0.254: J8.14 27.94,29.21 26.67,30.48 24.13,30.48 21.59,27.94 8.89,27.94 J2.8
N$1  (via drill 1.02 pad 1.88)
  other vias: 38.1,50.8
N$2  (via drill 1.02 pad 1.88)
  other vias: 33.02,50.8
N$3  (via drill 1.02 pad 1.88)
  other vias: 40.64,50.8
N$4  (via drill 1.02 pad 1.88)
  other vias: 35.56,50.8
N$5  (via drill 1.02 pad 1.88)
  other vias: 27.94,50.8
N$6  (via drill 1.02 pad 1.88)
  other vias: 30.48,50.8
N$7  (via drill 1.02 pad 1.88)
  other vias: 25.4,50.8
N$8  (via drill 1.02 pad 1.88)
  other vias: 22.86,50.8
N$9  (via drill 1.02 pad 1.88)
  other vias: 20.32,50.8
N$10  (via drill 1.02 pad 1.88)
  other vias: 17.78,50.8
N$11  (via drill 1.02 pad 1.88)
  other vias: 15.24,50.8
N$12  (via drill 1.02 pad 1.88)
  other vias: 15.24,53.34
N$13  (via drill 1.02 pad 1.88)
  other vias: 17.78,53.34
N$14  (via drill 1.02 pad 1.88)
  other vias: 20.32,53.34
N$15  (via drill 1.02 pad 1.88)
  other vias: 22.86,53.34
N$16  (via drill 1.02 pad 1.88)
  other vias: 25.4,53.34
N$17  (via drill 1.02 pad 1.88)
  other vias: 27.94,53.34
N$18  (via drill 1.02 pad 1.88)
  other vias: 30.48,53.34
N$19  (via drill 1.02 pad 1.88)
  other vias: 33.02,53.34
N$20  (via drill 1.02 pad 1.88)
  other vias: 35.56,53.34
N$21  (via drill 1.02 pad 1.88)
  other vias: 38.1,53.34
N$22  (via drill 1.02 pad 1.88)
  other vias: 40.64,53.34
N$23  (via drill 1.02 pad 1.88)
  other vias: 15.24,55.88
N$24  (via drill 1.02 pad 1.88)
  other vias: 17.78,55.88
N$25  (via drill 1.02 pad 1.88)
  other vias: 20.32,55.88
N$26  (via drill 1.02 pad 1.88)
  other vias: 22.86,55.88
N$27  (via drill 1.02 pad 1.88)
  other vias: 25.4,55.88
N$28  (via drill 1.02 pad 1.88)
  other vias: 27.94,55.88
N$29  (via drill 1.02 pad 1.88)
  other vias: 30.48,55.88
N$30  (via drill 1.02 pad 1.88)
  other vias: 33.02,55.88
N$31  (via drill 1.02 pad 1.88)
  other vias: 35.56,55.88
N$32  (via drill 1.02 pad 1.88)
  other vias: 38.1,55.88
N$33  (via drill 1.02 pad 1.88)
  other vias: 40.64,55.88
N$34  (via drill 1.02 pad 1.88)
  other vias: 43.18,58.42
N$35  (via drill 1.02 pad 1.88)
  other vias: 38.1,58.42
N$36  (via drill 1.02 pad 1.88)
  other vias: 35.56,58.42
N$37  (via drill 1.02 pad 1.88)
  other vias: 33.02,58.42
N$38  (via drill 1.02 pad 1.88)
  other vias: 30.48,58.42
N$39  (via drill 1.02 pad 1.88)
  other vias: 27.94,58.42
N$40  (via drill 1.02 pad 1.88)
  other vias: 25.4,58.42
N$41  (via drill 1.02 pad 1.88)
  other vias: 22.86,58.42
N$42  (via drill 1.02 pad 1.88)
  other vias: 20.32,58.42
N$43  (via drill 1.02 pad 1.88)
  other vias: 17.78,58.42
N$44  (via drill 1.02 pad 1.88)
  other vias: 15.24,58.42
N$45  (via drill 1.02 pad 1.88)
  other vias: 27.94,60.96
N$46  (via drill 1.02 pad 1.88)
  other vias: 30.48,60.96
N$47  (via drill 1.02 pad 1.88)
  other vias: 33.02,60.96
N$48  (via drill 1.02 pad 1.88)
  other vias: 40.64,60.96
N$49  (via drill 1.02 pad 1.88)
  other vias: 35.56,60.96
N$50  (via drill 1.02 pad 1.88)
  other vias: 38.1,60.96
N$51  (via drill 1.02 pad 1.88)
  other vias: 25.4,60.96
N$52  (via drill 1.02 pad 1.88)
  other vias: 22.86,60.96
N$53  (via drill 1.02 pad 1.88)
  other vias: 20.32,60.96
N$54  (via drill 1.02 pad 1.88)
  other vias: 17.78,60.96
N$55  (via drill 1.02 pad 1.88)
  other vias: 15.24,60.96
N$56  (via drill 1.02 pad 1.88)
  other vias: 15.24,63.5
N$57  (via drill 1.02 pad 1.88)
  other vias: 17.78,63.5
N$58  (via drill 1.02 pad 1.88)
  other vias: 20.32,63.5
N$59  (via drill 1.02 pad 1.88)
  other vias: 22.86,63.5
N$60  (via drill 1.02 pad 1.88)
  other vias: 25.4,63.5
N$61  (via drill 1.02 pad 1.88)
  other vias: 27.94,63.5
N$62  (via drill 1.02 pad 1.88)
  other vias: 30.48,63.5
N$63  (via drill 1.02 pad 1.88)
  other vias: 33.02,63.5
N$64  (via drill 1.02 pad 1.88)
  other vias: 35.56,63.5
N$65  (via drill 1.02 pad 1.88)
  other vias: 38.1,63.5
N$66  (via drill 1.02 pad 1.88)
  other vias: 40.64,63.5
N$67  (via drill 1.02 pad 1.88)
  other vias: 15.24,66.04
N$68  (via drill 1.02 pad 1.88)
  other vias: 17.78,66.04
N$69  (via drill 1.02 pad 1.88)
  other vias: 20.32,66.04
N$70  (via drill 1.02 pad 1.88)
  other vias: 22.86,66.04
N$71  (via drill 1.02 pad 1.88)
  other vias: 25.4,66.04
N$72  (via drill 1.02 pad 1.88)
  other vias: 27.94,66.04
N$73  (via drill 1.02 pad 1.88)
  other vias: 30.48,66.04
N$74  (via drill 1.02 pad 1.88)
  other vias: 33.02,66.04
N$75  (via drill 1.02 pad 1.88)
  other vias: 35.56,66.04
N$76  (via drill 1.02 pad 1.88)
  other vias: 38.1,66.04
N$77  (via drill 1.02 pad 1.88)
  other vias: 40.64,66.04
N$78  (via drill 1.02 pad 1.88)
  other vias: 40.64,68.58
N$79  (via drill 1.02 pad 1.88)
  other vias: 38.1,68.58
N$80  (via drill 1.02 pad 1.88)
  other vias: 35.56,68.58
N$81  (via drill 1.02 pad 1.88)
  other vias: 33.02,68.58
N$82  (via drill 1.02 pad 1.88)
  other vias: 30.48,68.58
N$83  (via drill 1.02 pad 1.88)
  other vias: 27.94,68.58
N$84  (via drill 1.02 pad 1.88)
  other vias: 25.4,68.58
N$85  (via drill 1.02 pad 1.88)
  other vias: 22.86,68.58
N$86  (via drill 1.02 pad 1.88)
  other vias: 20.32,68.58
N$87  (via drill 1.02 pad 1.88)
  other vias: 17.78,68.58
N$88  (via drill 1.02 pad 1.88)
  other vias: 15.24,68.58
N$89  (via drill 1.02 pad 1.88)
  other vias: 27.94,71.12
N$90  (via drill 1.02 pad 1.88)
  other vias: 30.48,71.12
N$91  (via drill 1.02 pad 1.88)
  other vias: 33.02,71.12
N$92  (via drill 1.02 pad 1.88)
  other vias: 40.64,71.12
N$93  (via drill 1.02 pad 1.88)
  other vias: 35.56,71.12
N$94  (via drill 1.02 pad 1.88)
  other vias: 38.1,71.12
N$95  (via drill 1.02 pad 1.88)
  other vias: 25.4,71.12
N$96  (via drill 1.02 pad 1.88)
  other vias: 22.86,71.12
N$97  (via drill 1.02 pad 1.88)
  other vias: 20.32,71.12
N$98  (via drill 1.02 pad 1.88)
  other vias: 17.78,71.12
N$99  (via drill 1.02 pad 1.88)
  other vias: 15.24,71.12
N$100  (via drill 1.02 pad 1.88)
  other vias: 15.24,73.66
N$101  (via drill 1.02 pad 1.88)
  other vias: 17.78,73.66
N$102  (via drill 1.02 pad 1.88)
  other vias: 20.32,73.66
N$103  (via drill 1.02 pad 1.88)
  other vias: 22.86,73.66
N$104  (via drill 1.02 pad 1.88)
  other vias: 25.4,73.66
N$105  (via drill 1.02 pad 1.88)
  other vias: 27.94,73.66
N$106  (via drill 1.02 pad 1.88)
  other vias: 30.48,73.66
N$107  (via drill 1.02 pad 1.88)
  other vias: 33.02,73.66
N$108  (via drill 1.02 pad 1.88)
  other vias: 35.56,73.66
N$109  (via drill 1.02 pad 1.88)
  other vias: 38.1,73.66
N$110  (via drill 1.02 pad 1.88)
  other vias: 40.64,73.66
N$111  (via drill 1.02 pad 1.88)
  other vias: 15.24,76.2
N$112  (via drill 1.02 pad 1.88)
  other vias: 17.78,76.2
N$113  (via drill 1.02 pad 1.88)
  other vias: 20.32,76.2
N$114  (via drill 1.02 pad 1.88)
  other vias: 22.86,76.2
N$115  (via drill 1.02 pad 1.88)
  other vias: 25.4,76.2
N$116  (via drill 1.02 pad 1.88)
  other vias: 27.94,76.2
N$117  (via drill 1.02 pad 1.88)
  other vias: 30.48,76.2
N$118  (via drill 1.02 pad 1.88)
  other vias: 33.02,76.2
N$119  (via drill 1.02 pad 1.88)
  other vias: 35.56,76.2
N$120  (via drill 1.02 pad 1.88)
  other vias: 38.1,76.2
N$121  (via drill 1.02 pad 1.88)
  other vias: 40.64,76.2
N$122  (via drill 1.02 pad 1.88)
  other vias: 40.64,78.74
N$123  (via drill 1.02 pad 1.88)
  other vias: 38.1,78.74
N$124  (via drill 1.02 pad 1.88)
  other vias: 35.56,78.74
N$125  (via drill 1.02 pad 1.88)
  other vias: 33.02,78.74
N$126  (via drill 1.02 pad 1.88)
  other vias: 30.48,78.74
N$127  (via drill 1.02 pad 1.88)
  other vias: 27.94,78.74
N$128  (via drill 1.02 pad 1.88)
  other vias: 25.4,78.74
N$129  (via drill 1.02 pad 1.88)
  other vias: 22.86,78.74
N$130  (via drill 1.02 pad 1.88)
  other vias: 20.32,78.74
N$131  (via drill 1.02 pad 1.88)
  other vias: 17.78,78.74
N$132  (via drill 1.02 pad 1.88)
  other vias: 15.24,78.74
N$133  (via drill 1.02 pad 1.88)
  other vias: 40.64,81.28
N$134  (via drill 1.02 pad 1.88)
  other vias: 38.1,81.28
N$135  (via drill 1.02 pad 1.88)
  other vias: 35.56,81.28
N$136  (via drill 1.02 pad 1.88)
  other vias: 33.02,81.28
N$137  (via drill 1.02 pad 1.88)
  other vias: 30.48,81.28
N$138  (via drill 1.02 pad 1.88)
  other vias: 27.94,81.28
N$139  (via drill 1.02 pad 1.88)
  other vias: 25.4,81.28
N$140  (via drill 1.02 pad 1.88)
  other vias: 22.86,81.28
N$141  (via drill 1.02 pad 1.88)
  other vias: 20.32,81.28
N$142  (via drill 1.02 pad 1.88)
  other vias: 17.78,81.28
N$143  (via drill 1.02 pad 1.88)
  other vias: 15.24,81.28
N$144  (via drill 1.02 pad 1.88)
  other vias: 43.18,60.96
N$145  (via drill 1.02 pad 1.88)
  other vias: 43.18,63.5
N$146  (via drill 1.02 pad 1.88)
  other vias: 43.18,66.04
N$147  (via drill 1.02 pad 1.88)
  other vias: 43.18,68.58
N$148  (via drill 1.02 pad 1.88)
  other vias: 43.18,71.12
N$149  (via drill 1.02 pad 1.88)
  other vias: 43.18,73.66
N$150  (via drill 1.02 pad 1.88)
  other vias: 43.18,76.2
N$151  (via drill 1.02 pad 1.88)
  other vias: 43.18,78.74
N$152  (via drill 1.02 pad 1.88)
  other vias: 43.18,81.28
N$153  (via drill 1.02 pad 1.88)
  other vias: 40.64,58.42
OE
  Top 0.254: B1.9 J2.9 8.89,27.94 11.43,27.94 12.7,26.67 J8.15
R0
  Top 0.254: B1.24 6.35,85.09 6.35,87.63 7.62,88.9 J12.3
  Bottom 0.152: J8.1 26.41,44.45 27.58,45.62 28.55,45.62 29.23,44.93 29.23,43.97 28.55,43.28 27.33,43.28 26.75,42.7 26.75,39.19 25.76,38.2 24.79,38.2 24.11,38.89 24.11,39.01 22.86,40.26 14.76,40.26 12.09,42.93 12.09,79.35 B1.24
R1
  Top 0.152: J8.5 26.41,39.37 27.58,40.54 28.55,40.54 29.23,39.85 29.23,38.89 28.35,38 27.58,38 26.75,37.16 26.75,34.11 25.76,33.12 24.79,33.12 24.11,33.81 24.11,34.31 22.86,35.56 14.38,35.56 12.09,37.85 12.09,82.78 11.53,83.34 11.53,84.99 B1.27
  Top 0.254: B1.27 10.16,87.51 11.38,88.73 11.38,90.67 10.16,91.89 J11.15
SCL
  Top 0.254: B1.SCL J2.1 | J5.8 B1.21
  Bottom 0.254: J2.1 6.35,8.89 5.08,10.16 5.08,73.66 J5.8
SDA
  Top 0.254: J2.2 B1.SDA | B1.20 J5.7
  Bottom 0.254: J2.2 6.35,12.7 6.35,72.39 J5.7
VIN
  Bottom 2.032: B1.VIN J4.1 45.29,35.99 45.29,36.43 44.05,37.67 41.48,37.67 31.75,27.94 31.75,6.43 J7.2

### Text on the board
Bottom: X10
Dimension: Route out
Measures: Measurements in in
tDocu: N. Seidle